# EAGLE schematic Driver_Board_Niall (EAGLE 9.1.3)
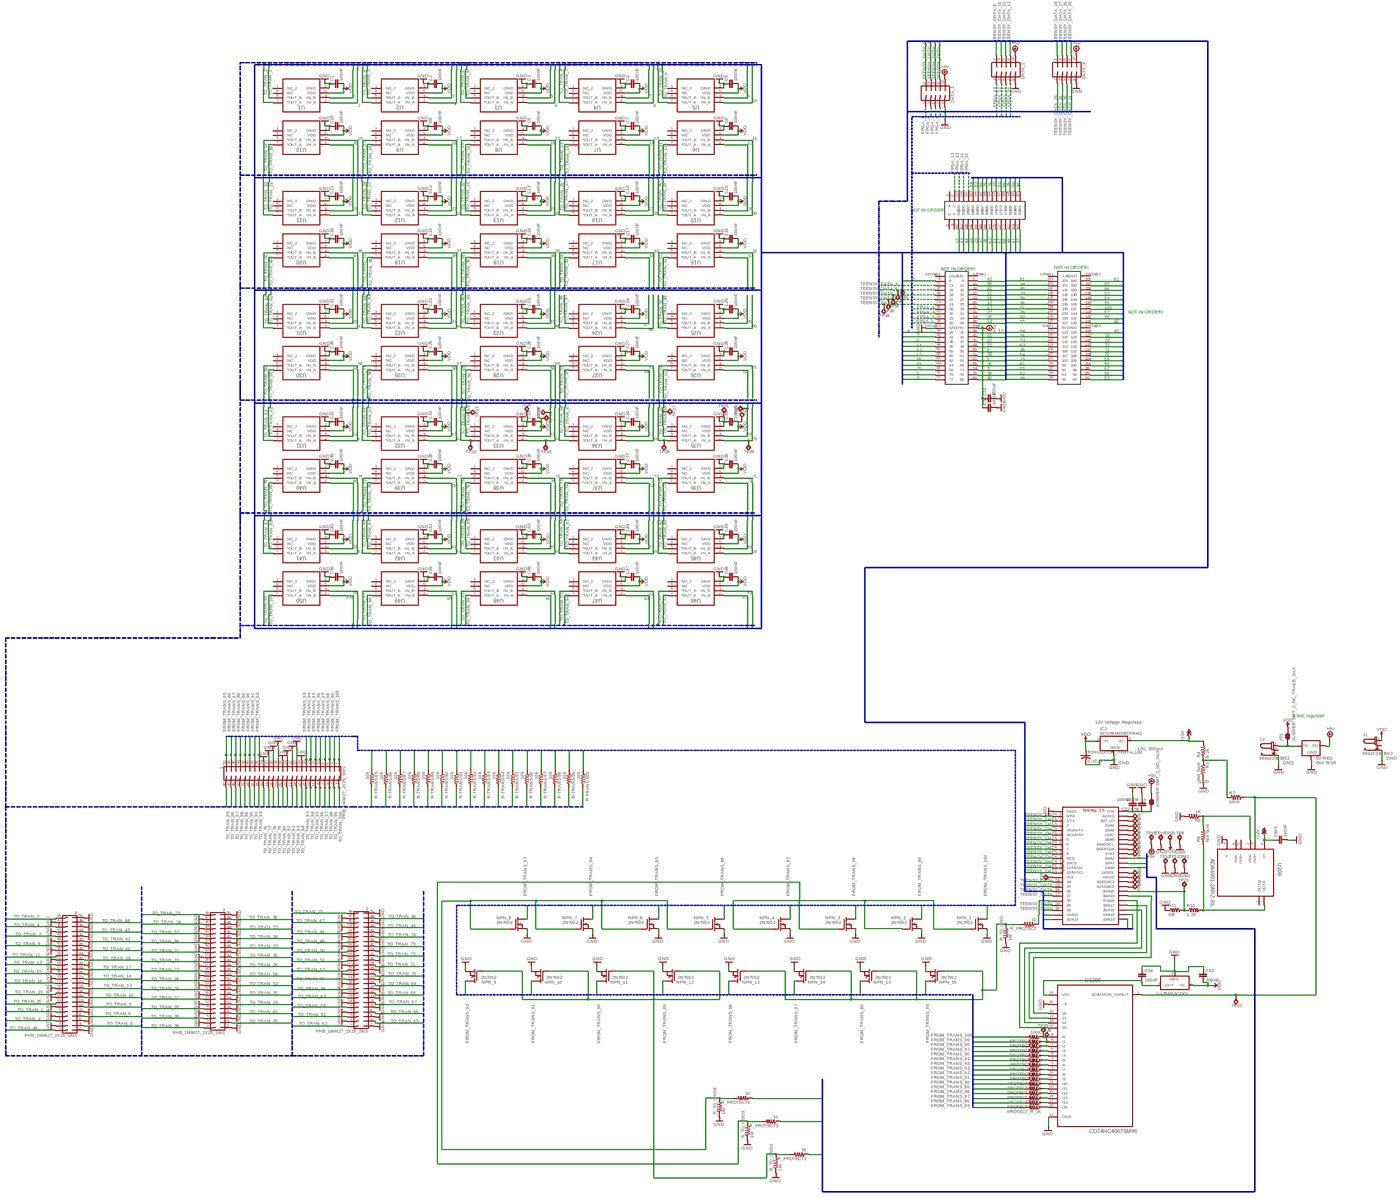
[diagram p0: schematic, sheet 1, overview]
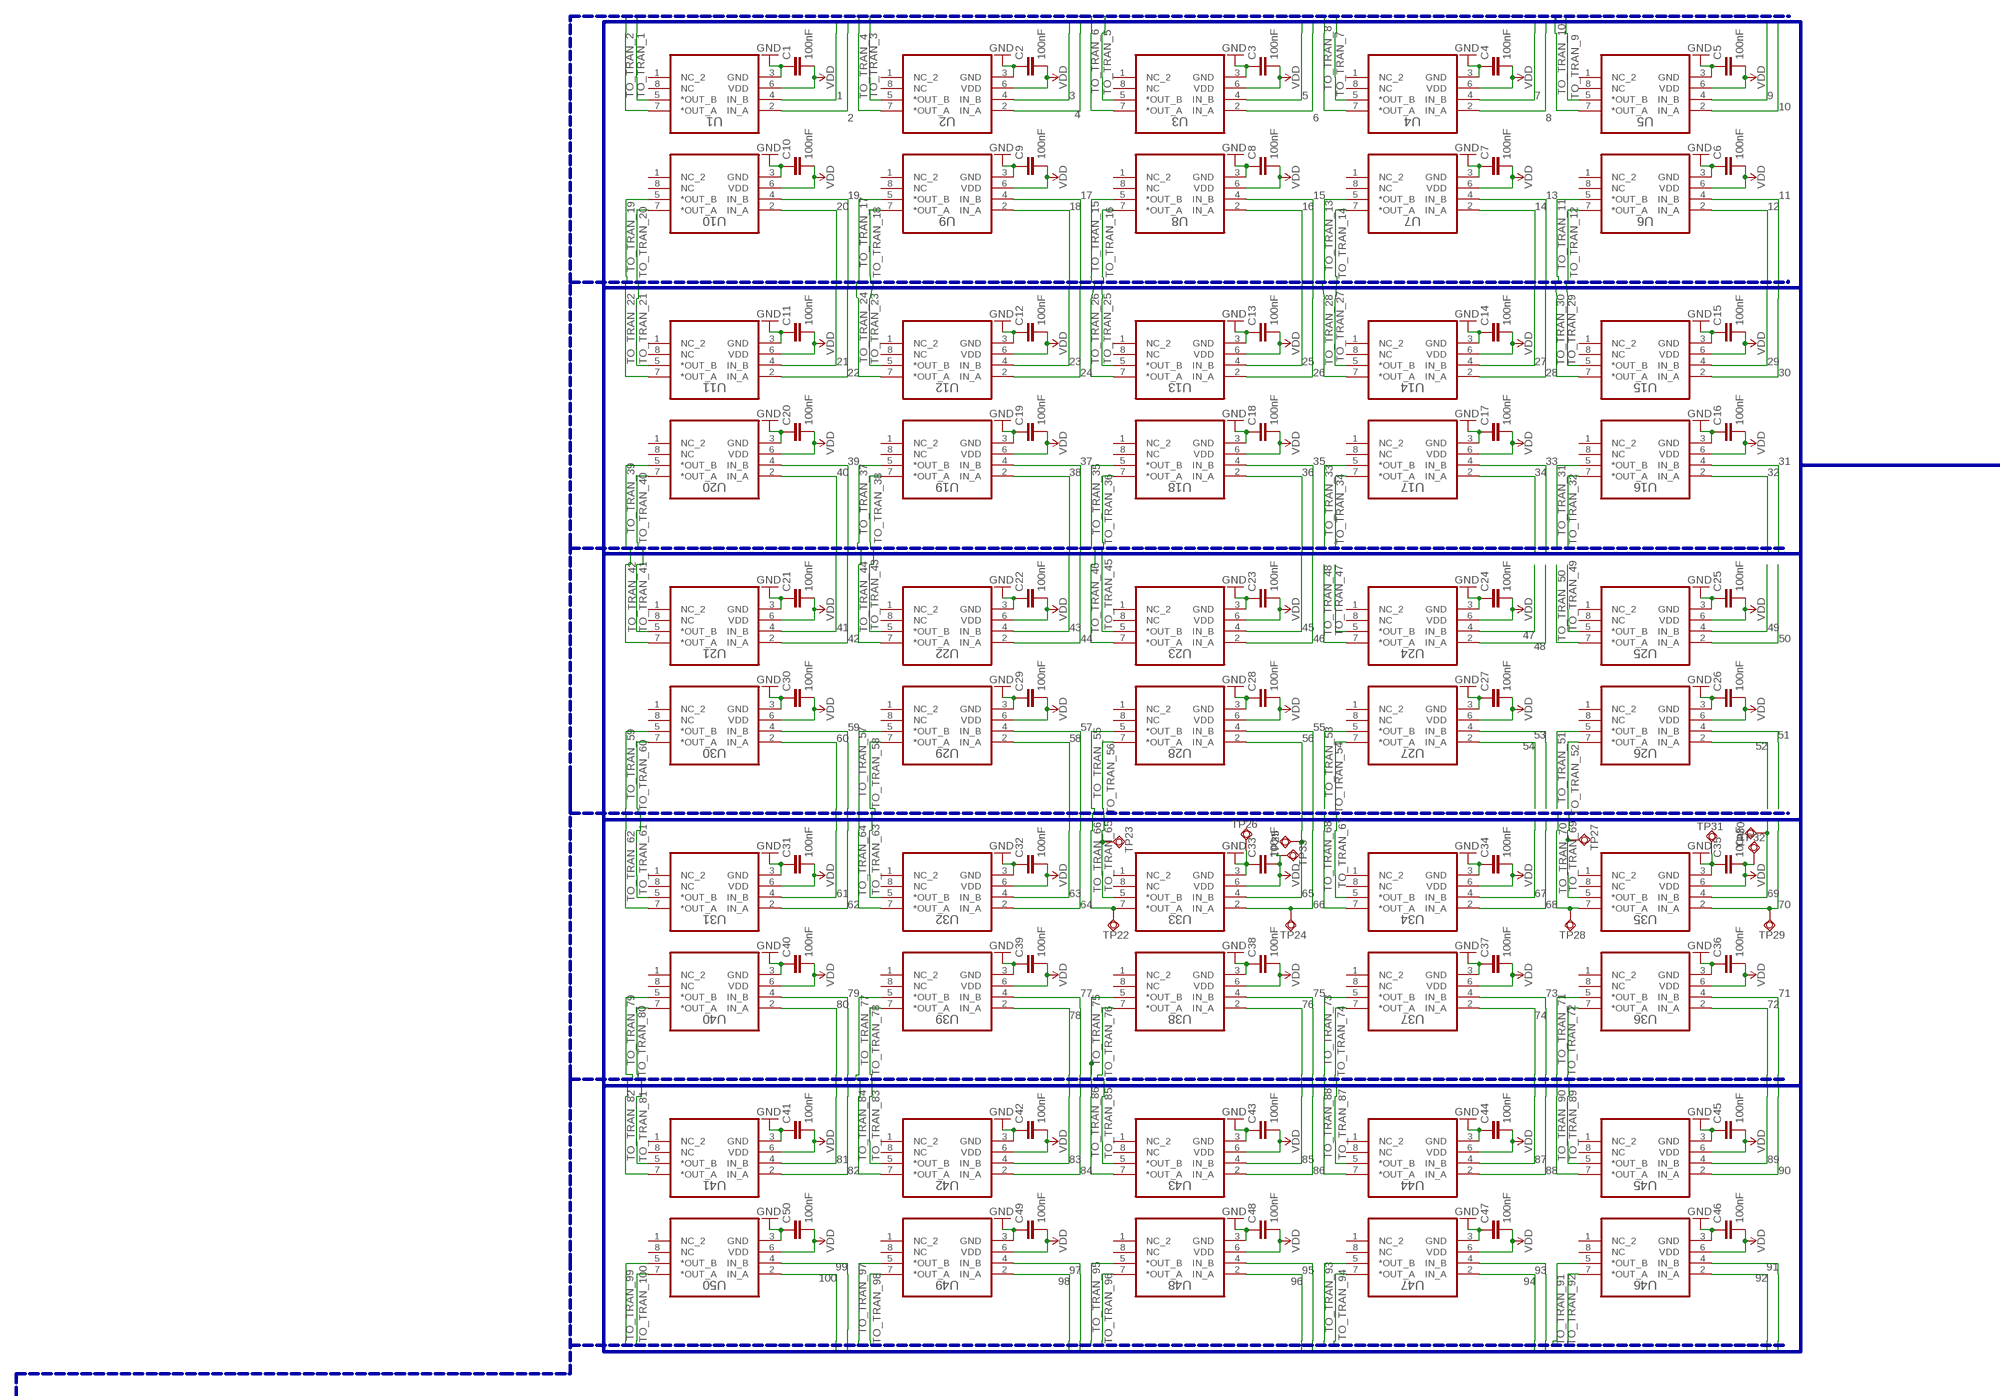
[diagram p1: schematic, sheet 1, part 1 of 4]
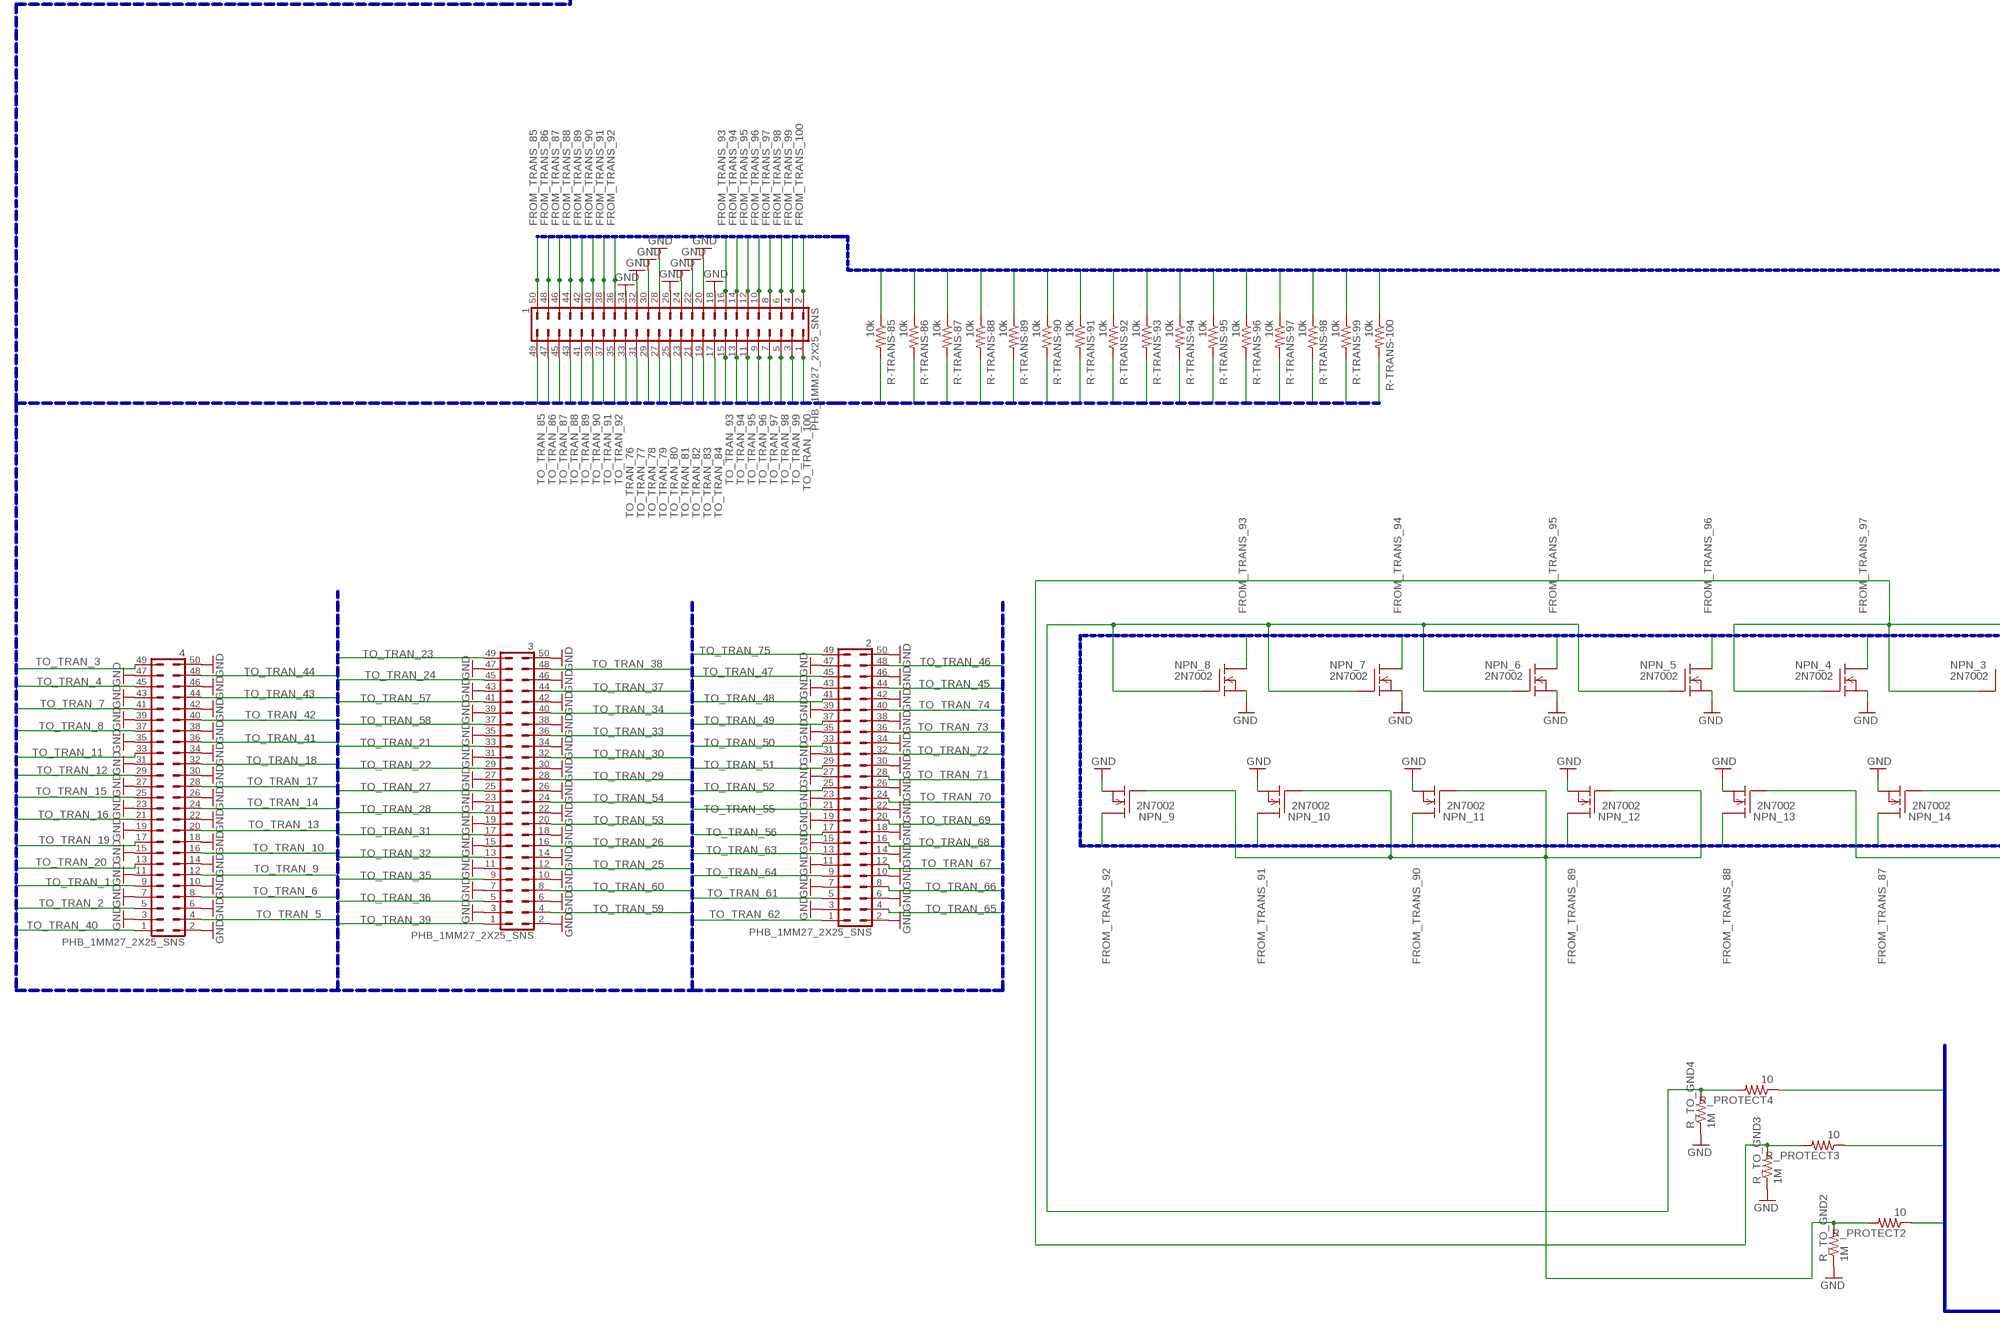
[diagram p2: schematic, sheet 1, part 2 of 4]
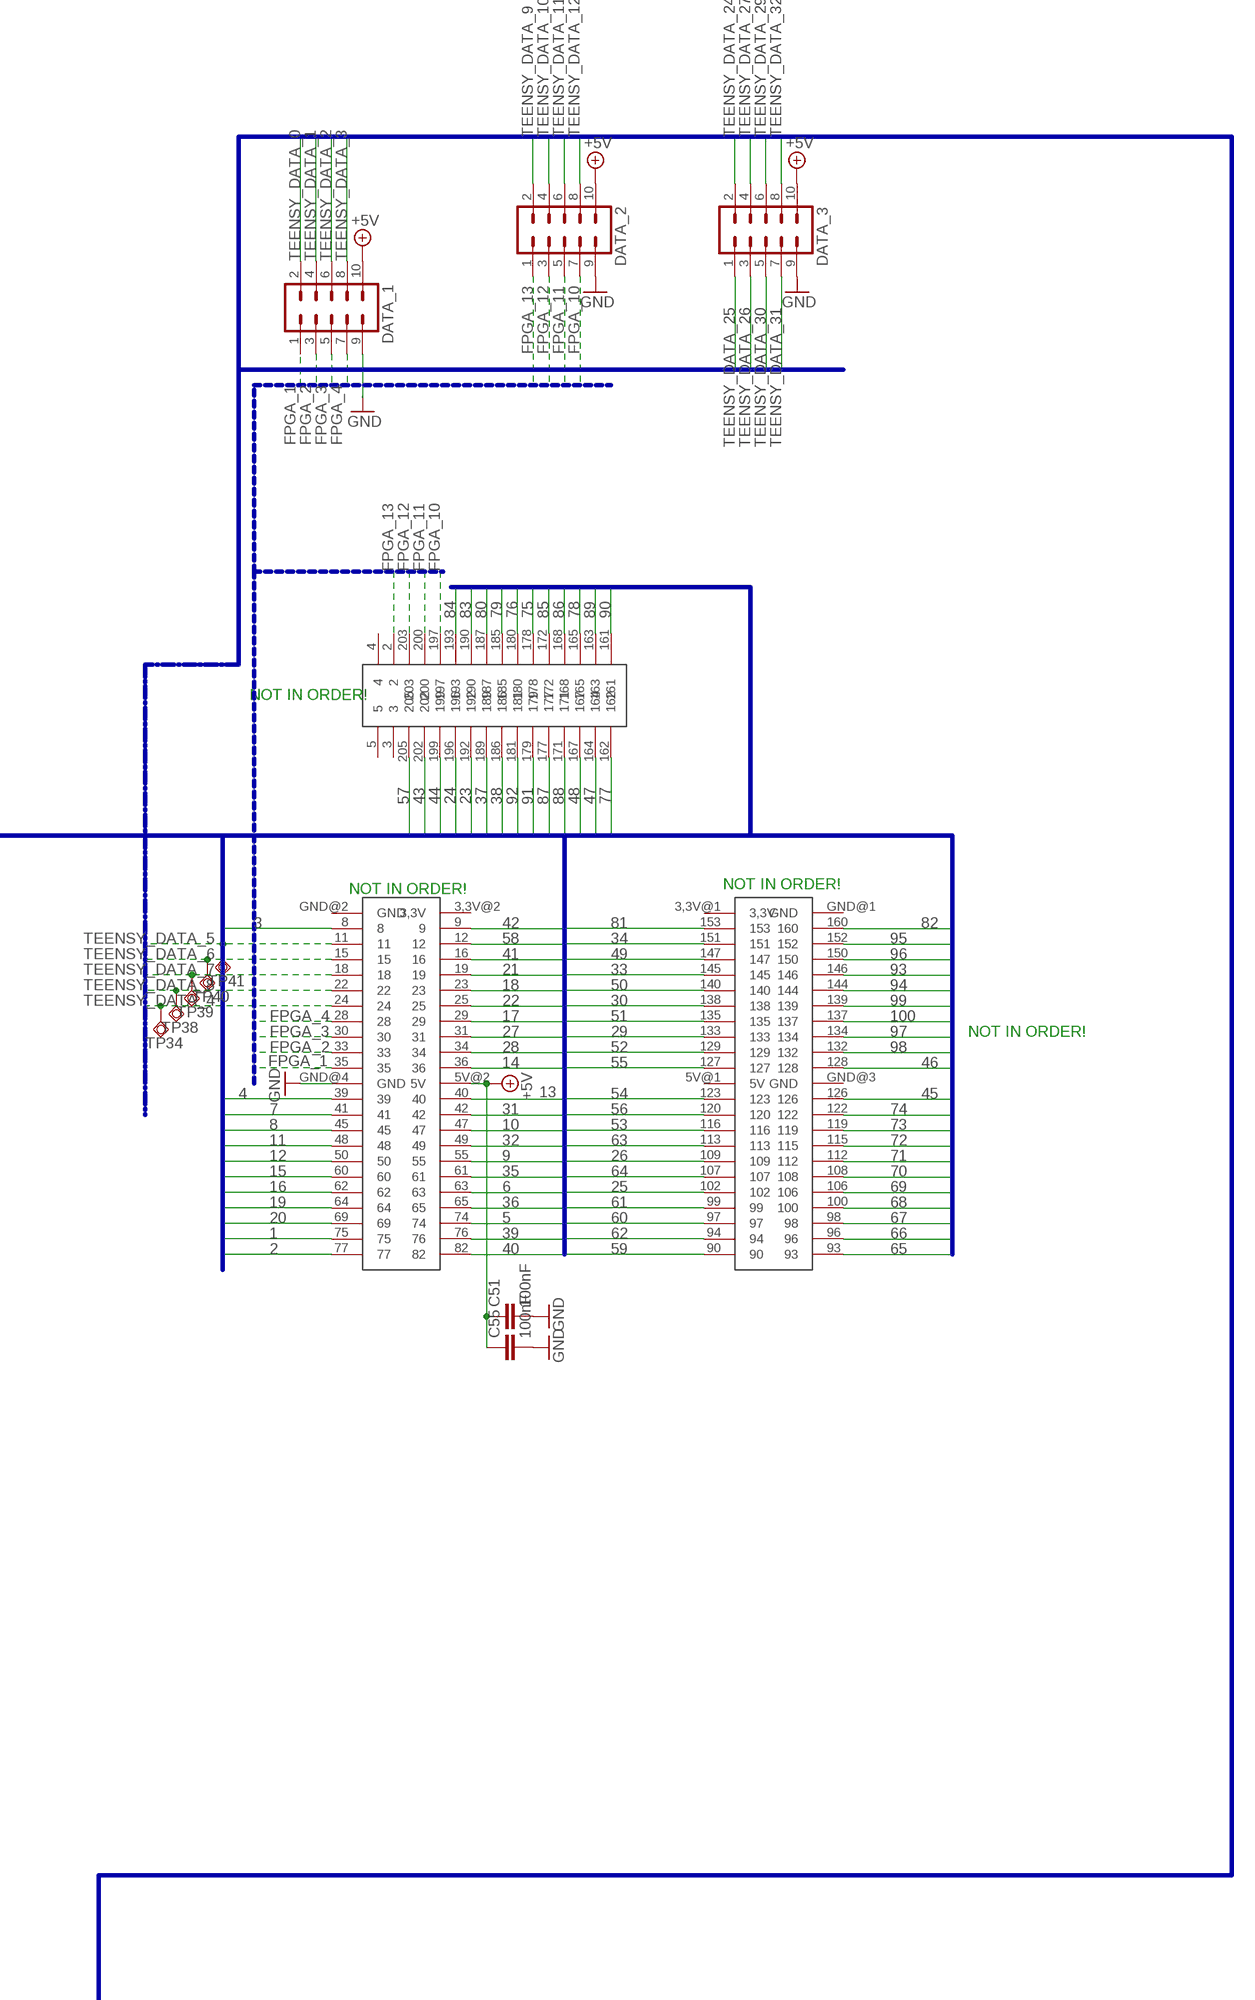
[diagram p3: schematic, sheet 1, part 3 of 4]
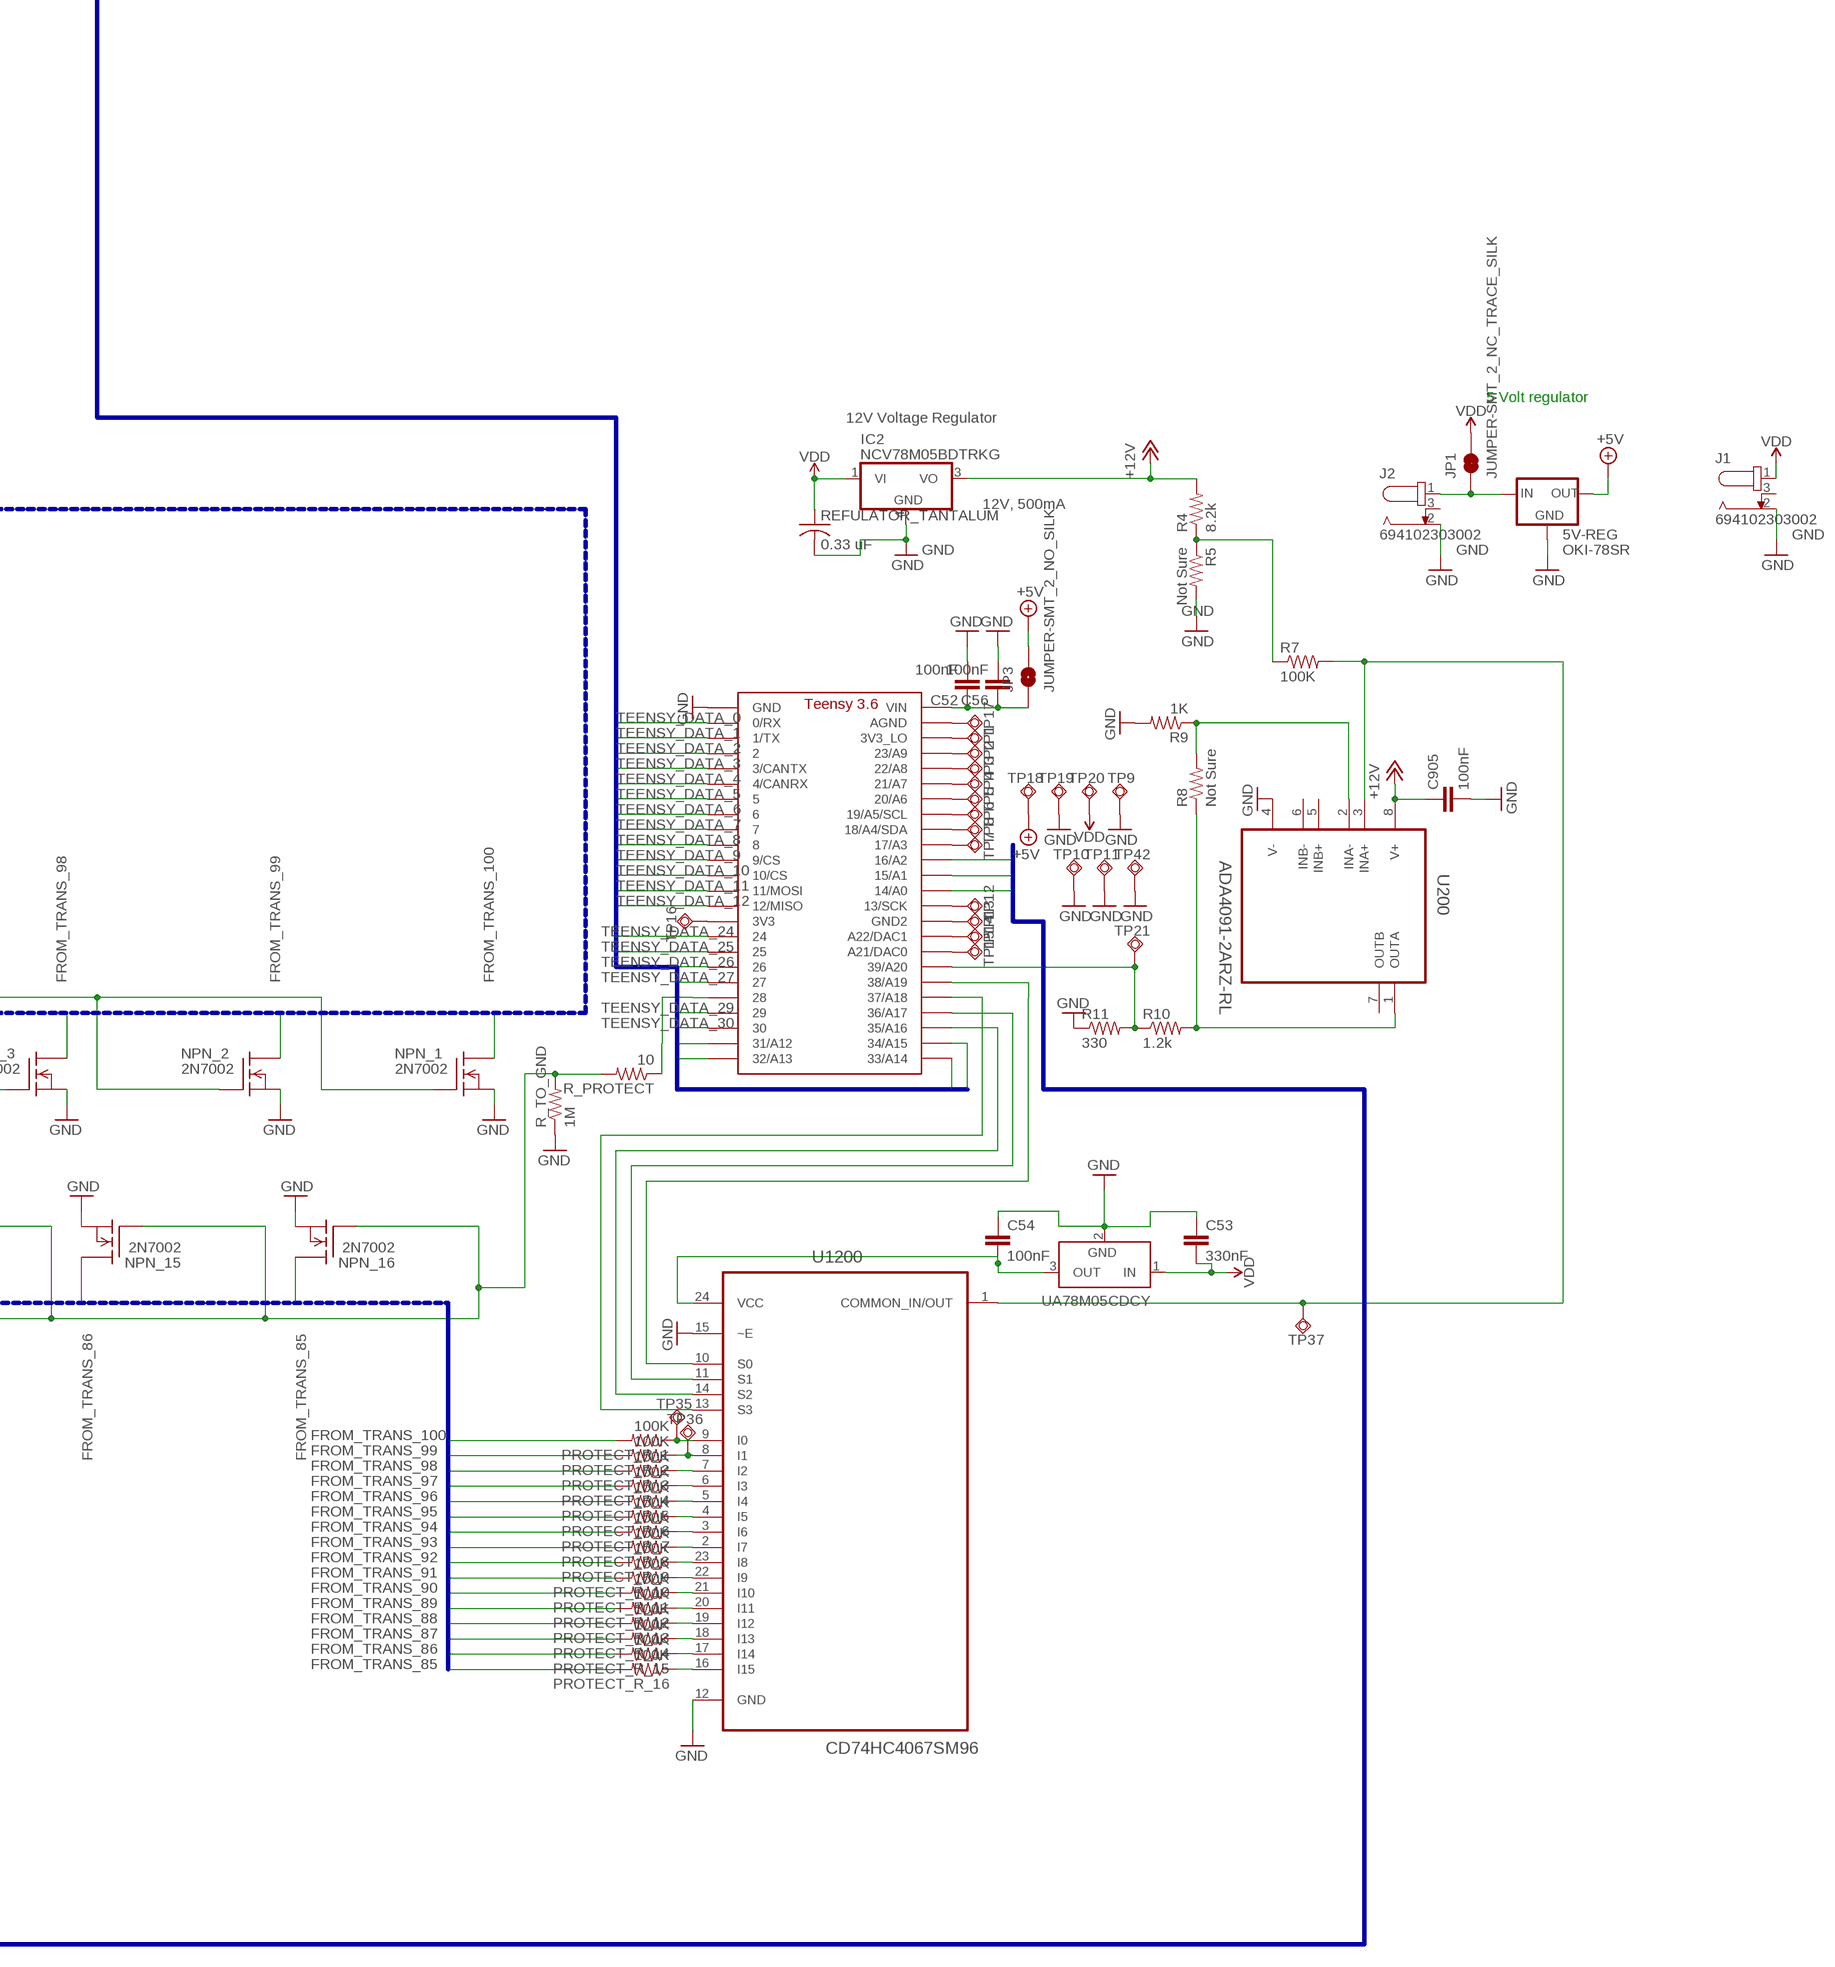
[diagram p4: schematic, sheet 1, part 4 of 4]

## Parts
1  PHB_1MM27_2X25_SNS  [PHB_1MM27_2X25_SNS]
2  PHB_1MM27_2X25_SNS  [PHB_1MM27_2X25_SNS]
3  PHB_1MM27_2X25_SNS  [PHB_1MM27_2X25_SNS]
4  PHB_1MM27_2X25_SNS  [PHB_1MM27_2X25_SNS]
5V-REG  OKI-78SR  [OKI-78SR-HORIZ]
C1  100nF  C-EUC0805  [C0805]
C2  100nF  C-EUC0805  [C0805]
C3  100nF  C-EUC0805  [C0805]
C4  100nF  C-EUC0805  [C0805]
C5  100nF  C-EUC0805  [C0805]
C6  100nF  C-EUC0805  [C0805]
C7  100nF  C-EUC0805  [C0805]
C8  100nF  C-EUC0805  [C0805]
C9  100nF  C-EUC0805  [C0805]
C10  100nF  C-EUC0805  [C0805]
C11  100nF  C-EUC0805  [C0805]
C12  100nF  C-EUC0805  [C0805]
C13  100nF  C-EUC0805  [C0805]
C14  100nF  C-EUC0805  [C0805]
C15  100nF  C-EUC0805  [C0805]
C16  100nF  C-EUC0805  [C0805]
C17  100nF  C-EUC0805  [C0805]
C18  100nF  C-EUC0805  [C0805]
C19  100nF  C-EUC0805  [C0805]
C20  100nF  C-EUC0805  [C0805]
C21  100nF  C-EUC0805  [C0805]
C22  100nF  C-EUC0805  [C0805]
C23  100nF  C-EUC0805  [C0805]
C24  100nF  C-EUC0805  [C0805]
C25  100nF  C-EUC0805  [C0805]
C26  100nF  C-EUC0805  [C0805]
C27  100nF  C-EUC0805  [C0805]
C28  100nF  C-EUC0805  [C0805]
C29  100nF  C-EUC0805  [C0805]
C30  100nF  C-EUC0805  [C0805]
C31  100nF  C-EUC0805  [C0805]
C32  100nF  C-EUC0805  [C0805]
C33  100nF  C-EUC0805  [C0805]
C34  100nF  C-EUC0805  [C0805]
C35  100nF  C-EUC0805  [C0805]
C36  100nF  C-EUC0805  [C0805]
C37  100nF  C-EUC0805  [C0805]
C38  100nF  C-EUC0805  [C0805]
C39  100nF  C-EUC0805  [C0805]
C40  100nF  C-EUC0805  [C0805]
C41  100nF  C-EUC0805  [C0805]
C42  100nF  C-EUC0805  [C0805]
C43  100nF  C-EUC0805  [C0805]
C44  100nF  C-EUC0805  [C0805]
C45  100nF  C-EUC0805  [C0805]
C46  100nF  C-EUC0805  [C0805]
C47  100nF  C-EUC0805  [C0805]
C48  100nF  C-EUC0805  [C0805]
C49  100nF  C-EUC0805  [C0805]
C50  100nF  C-EUC0805  [C0805]
C51  100nF  C-EUC0805  [C0805]
C52  100nF  C-EUC0805  [C0805]
C53  330nF  C-EUC0805  [C0805]
C54  100nF  C-EUC0805  [C0805]
C55  100nF  C-EUC0805  [C0805]
C56  100nF  C-EUC0805  [C0805]
C905  100nF  C-EUC0805  [C0805]
DATA_1  MA05-2  [MA05-2]
DATA_2  MA05-2  [MA05-2]
DATA_3  MA05-2  [MA05-2]
DIP2  CORE3S500ESMT  [CORE3S500E-SMT]
IC2  NCV78M05BDTRKG  [DPACK_3]
J1  694102303002  [69410X303002]
J2  694102303002  [69410X303002]
JP1  JUMPER-SMT_2_NC_TRACE_SILK  [SMT-JUMPER_2_NC_TRACE_SILK]
JP3  JUMPER-SMT_2_NO_SILK  [SMT-JUMPER_2_NO_SILK]
NPN_1  2N7002  [SOT23]
NPN_2  2N7002  [SOT23]
NPN_3  2N7002  [SOT23]
NPN_4  2N7002  [SOT23]
NPN_5  2N7002  [SOT23]
NPN_6  2N7002  [SOT23]
NPN_7  2N7002  [SOT23]
NPN_8  2N7002  [SOT23]
NPN_9  2N7002  [SOT23]
NPN_10  2N7002  [SOT23]
NPN_11  2N7002  [SOT23]
NPN_12  2N7002  [SOT23]
NPN_13  2N7002  [SOT23]
NPN_14  2N7002  [SOT23]
NPN_15  2N7002  [SOT23]
NPN_16  2N7002  [SOT23]
PROTECT_R_1  100K  R-US_M0805  [M0805]
PROTECT_R_2  100K  R-US_M0805  [M0805]
PROTECT_R_3  100K  R-US_M0805  [M0805]
PROTECT_R_4  100K  R-US_M0805  [M0805]
PROTECT_R_5  100K  R-US_M0805  [M0805]
PROTECT_R_6  100K  R-US_M0805  [M0805]
PROTECT_R_7  100K  R-US_M0805  [M0805]
PROTECT_R_8  100K  R-US_M0805  [M0805]
PROTECT_R_9  100K  R-US_M0805  [M0805]
PROTECT_R_10  100K  R-US_M0805  [M0805]
PROTECT_R_11  100K  R-US_M0805  [M0805]
PROTECT_R_12  100K  R-US_M0805  [M0805]
PROTECT_R_13  100K  R-US_M0805  [M0805]
PROTECT_R_14  100K  R-US_M0805  [M0805]
PROTECT_R_15  100K  R-US_M0805  [M0805]
PROTECT_R_16  100K  R-US_M0805  [M0805]
R4  8.2k  R-US_M0805  [M0805]
R5  Not Sure  R-US_M0805  [M0805]
R7  100K  R-US_M0805  [M0805]
R8  Not Sure  R-US_M0805  [M0805]
R9  1K  R-US_M0805  [M0805]
R10  1.2k  R-US_M0805  [M0805]
R11  330  R-US_M0805  [M0805]
R-TRANS-85  10k  R-US_M0805  [M0805]
R-TRANS-86  10k  R-US_M0805  [M0805]
R-TRANS-87  10k  R-US_M0805  [M0805]
R-TRANS-88  10k  R-US_M0805  [M0805]
R-TRANS-89  10k  R-US_M0805  [M0805]
R-TRANS-90  10k  R-US_M0805  [M0805]
R-TRANS-91  10k  R-US_M0805  [M0805]
R-TRANS-92  10k  R-US_M0805  [M0805]
R-TRANS-93  10k  R-US_M0805  [M0805]
R-TRANS-94  10k  R-US_M0805  [M0805]
R-TRANS-95  10k  R-US_M0805  [M0805]
R-TRANS-96  10k  R-US_M0805  [M0805]
R-TRANS-97  10k  R-US_M0805  [M0805]
R-TRANS-98  10k  R-US_M0805  [M0805]
R-TRANS-99  10k  R-US_M0805  [M0805]
R-TRANS-100  10k  R-US_M0805  [M0805]
R_PROTECT  10  R-US_M0805  [M0805]
R_PROTECT2  10  R-US_M0805  [M0805]
R_PROTECT3  10  R-US_M0805  [M0805]
R_PROTECT4  10  R-US_M0805  [M0805]
R_TO_GND  1M  R-US_M0805  [M0805]
R_TO_GND2  1M  R-US_M0805  [M0805]
R_TO_GND3  1M  R-US_M0805  [M0805]
R_TO_GND4  1M  R-US_M0805  [M0805]
REFULATOR_TANTALUM  0.33 uF  C-USC1206  [C1206]
TP1  TPSQPAD1-13  [P1-13]
TP2  TPSQPAD1-13  [P1-13]
TP3  TPSQPAD1-13  [P1-13]
TP4  TPSQPAD1-13  [P1-13]
TP5  TPSQPAD1-13  [P1-13]
TP6  TPSQPAD1-13  [P1-13]
TP7  TPSQPAD1-13  [P1-13]
TP8  TPSQPAD1-13  [P1-13]
TP9  TPSQPAD1-13  [P1-13]
TP10  TPSQPAD1-13  [P1-13]
TP11  TPSQPAD1-13  [P1-13]
TP12  TPSQPAD1-13  [P1-13]
TP13  TPSQPAD1-13  [P1-13]
TP14  TPSQPAD1-13  [P1-13]
TP15  TPSQPAD1-13  [P1-13]
TP16  TPSQPAD1-13  [P1-13]
TP17  TPSQPAD1-13  [P1-13]
TP18  TPSQPAD1-13  [P1-13]
TP19  TPSQPAD1-13  [P1-13]
TP20  TPSQPAD1-13  [P1-13]
TP21  TPSQPAD1-13  [P1-13]
TP22  TPSQPAD1-13  [P1-13]
TP23  TPSQPAD1-13  [P1-13]
TP24  TPSQPAD1-13  [P1-13]
TP25  TPSQPAD1-13  [P1-13]
TP26  TPSQPAD1-13  [P1-13]
TP27  TPSQPAD1-13  [P1-13]
TP28  TPSQPAD1-13  [P1-13]
TP29  TPSQPAD1-13  [P1-13]
TP30  TPSQPAD1-13  [P1-13]
TP31  TPSQPAD1-13  [P1-13]
TP32  TPSQPAD1-13  [P1-13]
TP33  TPSQPAD1-13  [P1-13]
TP34  TPSQPAD1-13  [P1-13]
TP35  TPSQPAD1-13  [P1-13]
TP36  TPSQPAD1-13  [P1-13]
TP37  TPSQPAD1-13  [P1-13]
TP38  TPSQPAD1-13  [P1-13]
TP39  TPSQPAD1-13  [P1-13]
TP40  TPSQPAD1-13  [P1-13]
TP41  TPSQPAD1-13  [P1-13]
TP42  TPSQPAD1-13  [P1-13]
U1  TC4427AEOA  [SOIC127P600X175-8N]
U2  TC4427AEOA  [SOIC127P600X175-8N]
U3  TC4427AEOA  [SOIC127P600X175-8N]
U4  TC4427AEOA  [SOIC127P600X175-8N]
U5  TC4427AEOA  [SOIC127P600X175-8N]
U6  TC4427AEOA  [SOIC127P600X175-8N]
U7  TC4427AEOA  [SOIC127P600X175-8N]
U8  TC4427AEOA  [SOIC127P600X175-8N]
U9  TC4427AEOA  [SOIC127P600X175-8N]
U10  TC4427AEOA  [SOIC127P600X175-8N]
U11  TC4427AEOA  [SOIC127P600X175-8N]
U12  TC4427AEOA  [SOIC127P600X175-8N]
U13  TC4427AEOA  [SOIC127P600X175-8N]
U14  TC4427AEOA  [SOIC127P600X175-8N]
U15  TC4427AEOA  [SOIC127P600X175-8N]
U16  TC4427AEOA  [SOIC127P600X175-8N]
U17  TC4427AEOA  [SOIC127P600X175-8N]
U18  TC4427AEOA  [SOIC127P600X175-8N]
U19  TC4427AEOA  [SOIC127P600X175-8N]
U20  TC4427AEOA  [SOIC127P600X175-8N]
U21  TC4427AEOA  [SOIC127P600X175-8N]
U22  TC4427AEOA  [SOIC127P600X175-8N]
U23  TC4427AEOA  [SOIC127P600X175-8N]
U24  TC4427AEOA  [SOIC127P600X175-8N]
U25  TC4427AEOA  [SOIC127P600X175-8N]
U26  TC4427AEOA  [SOIC127P600X175-8N]
U27  TC4427AEOA  [SOIC127P600X175-8N]
U28  TC4427AEOA  [SOIC127P600X175-8N]
U29  TC4427AEOA  [SOIC127P600X175-8N]
U30  TC4427AEOA  [SOIC127P600X175-8N]
U31  TC4427AEOA  [SOIC127P600X175-8N]
U32  TC4427AEOA  [SOIC127P600X175-8N]
U33  TC4427AEOA  [SOIC127P600X175-8N]
U34  TC4427AEOA  [SOIC127P600X175-8N]
U35  TC4427AEOA  [SOIC127P600X175-8N]
U36  TC4427AEOA  [SOIC127P600X175-8N]
U37  TC4427AEOA  [SOIC127P600X175-8N]
U38  TC4427AEOA  [SOIC127P600X175-8N]
U39  TC4427AEOA  [SOIC127P600X175-8N]
U40  TC4427AEOA  [SOIC127P600X175-8N]
U41  TC4427AEOA  [SOIC127P600X175-8N]
U42  TC4427AEOA  [SOIC127P600X175-8N]
U43  TC4427AEOA  [SOIC127P600X175-8N]
U44  TC4427AEOA  [SOIC127P600X175-8N]
U45  TC4427AEOA  [SOIC127P600X175-8N]
U46  TC4427AEOA  [SOIC127P600X175-8N]
U47  TC4427AEOA  [SOIC127P600X175-8N]
U48  TC4427AEOA  [SOIC127P600X175-8N]
U49  TC4427AEOA  [SOIC127P600X175-8N]
U50  TC4427AEOA  [SOIC127P600X175-8N]
U200  ADA4091-2ARZ-RL  [ADA4091-2ARZ-RL_SOIC127P600X175-8N]
U1200  CD74HC4067SM96  [SOP65P780X200-24N]
U$1  TEENSY_SMD  [TEENSY_3.6_SMD]
UA78M05CDCY  LT1129CST5  [SOT223]

## Nets
1: DIP2.75 U1.4(IN_B)
2: DIP2.77 U1.2(IN_A)
3: DIP2.8 U2.4(IN_B)
4: DIP2.39 U2.2(IN_A)
5: DIP2.74 U3.4(IN_B)
6: DIP2.63 U3.2(IN_A)
7: DIP2.41 U4.4(IN_B)
8: DIP2.45 U4.2(IN_A)
9: DIP2.55 U5.4(IN_B)
10: DIP2.47 U5.2(IN_A)
11: DIP2.48 U6.4(IN_B)
12: DIP2.50 U6.2(IN_A)
13: DIP2.40 U7.4(IN_B)
14: DIP2.36 U7.2(IN_A)
15: DIP2.60 U8.4(IN_B)
16: DIP2.62 U8.2(IN_A)
17: DIP2.29 U9.4(IN_B)
18: DIP2.23 U9.2(IN_A)
19: DIP2.64 U10.4(IN_B)
20: DIP2.69 U10.2(IN_A)
21: DIP2.19 U11.4(IN_B)
22: DIP2.25 U11.2(IN_A)
23: DIP2.192 U12.4(IN_B)
24: DIP2.196 U12.2(IN_A)
25: DIP2.102 U13.4(IN_B)
26: DIP2.109 U13.2(IN_A)
27: DIP2.31 U14.4(IN_B)
28: DIP2.34 U14.2(IN_A)
29: DIP2.133 U15.4(IN_B)
30: DIP2.138 U15.2(IN_A)
31: DIP2.42 U16.4(IN_B)
32: DIP2.49 U16.2(IN_A)
33: DIP2.145 U17.4(IN_B)
34: DIP2.151 U17.2(IN_A)
35: DIP2.61 U18.4(IN_B)
36: DIP2.65 U18.2(IN_A)
37: DIP2.189 U19.4(IN_B)
38: DIP2.186 U19.2(IN_A)
39: DIP2.76 U20.4(IN_B)
40: DIP2.82 U20.2(IN_A)
41: DIP2.16 U21.4(IN_B)
42: DIP2.9 U21.2(IN_A)
43: DIP2.202 U22.4(IN_B)
44: DIP2.199 U22.2(IN_A)
45: DIP2.126 U23.4(IN_B)
46: DIP2.128 U23.2(IN_A)
47: DIP2.164 U24.4(IN_B)
48: DIP2.167 U24.2(IN_A)
49: DIP2.147 U25.4(IN_B)
50: DIP2.140 U25.2(IN_A)
51: DIP2.135 U26.4(IN_B)
52: DIP2.129 U26.2(IN_A)
53: DIP2.116 U27.4(IN_B)
54: DIP2.123 U27.2(IN_A)
55: DIP2.127 U28.4(IN_B)
56: DIP2.120 U28.2(IN_A)
57: DIP2.205 U29.4(IN_B)
58: DIP2.12 U29.2(IN_A)
59: DIP2.90 U30.4(IN_B)
60: DIP2.97 U30.2(IN_A)
61: DIP2.99 U31.4(IN_B)
62: DIP2.94 U31.2(IN_A)
63: DIP2.113 U32.4(IN_B)
64: DIP2.107 U32.2(IN_A)
65: DIP2.93 TP25.TP U33.4(IN_B)
66: DIP2.96 TP24.TP U33.2(IN_A)
67: DIP2.98 U34.4(IN_B)
68: DIP2.100 U34.2(IN_A)
69: DIP2.106 TP30.TP U35.4(IN_B)
70: DIP2.108 TP29.TP U35.2(IN_A)
71: DIP2.112 U36.4(IN_B)
72: DIP2.115 U36.2(IN_A)
73: DIP2.119 U37.4(IN_B)
74: DIP2.122 U37.2(IN_A)
75: DIP2.178 U38.4(IN_B)
76: DIP2.180 U38.2(IN_A)
77: DIP2.162 U39.4(IN_B)
78: DIP2.165 U39.2(IN_A)
79: DIP2.185 U40.4(IN_B)
80: DIP2.187 U40.2(IN_A)
81: DIP2.153 U41.4(IN_B)
82: DIP2.160 U41.2(IN_A)
83: DIP2.190 U42.4(IN_B)
84: DIP2.193 U42.2(IN_A)
85: DIP2.172 U43.4(IN_B)
86: DIP2.168 U43.2(IN_A)
87: DIP2.177 U44.4(IN_B)
88: DIP2.171 U44.2(IN_A)
89: DIP2.163 U45.4(IN_B)
90: DIP2.161 U45.2(IN_A)
91: DIP2.179 U46.4(IN_B)
92: DIP2.181 U46.2(IN_A)
93: DIP2.146 U47.4(IN_B)
94: DIP2.144 U47.2(IN_A)
95: DIP2.152 U48.4(IN_B)
96: DIP2.150 U48.2(IN_A)
97: DIP2.134 U49.4(IN_B)
98: DIP2.132 U49.2(IN_A)
99: DIP2.139 U50.4(IN_B)
100: DIP2.137 U50.2(IN_A)
+5V: 5V-REG.OUT C51.1 C55.1 DATA_1.10 DATA_2.10 DATA_3.10 DIP2.5V@2(5V) JP3.2 TP18.TP
+12V: C905.1 IC2.3(VO) R4.2 U200.8(V+)
FET_2: R_PROTECT2.1 U$1.16/A4(16/A2)
FET_3: R_PROTECT3.1 U$1.15/A4(15/A1)
FET_4: R_PROTECT4.1 U$1.14/A3(14/A0)
FPGA_1: DATA_1.1 DIP2.35
FPGA_2: DATA_1.3 DIP2.33
FPGA_3: DATA_1.5 DIP2.30
FPGA_4: DATA_1.7 DIP2.28
FPGA_10: DATA_2.7 DIP2.197
FPGA_11: DATA_2.5 DIP2.200
FPGA_12: DATA_2.3 DIP2.203
FPGA_13: DATA_2.1 DIP2.2
FROM_TRANS_85: 1.50 NPN_16.3(D) PROTECT_R_16.2 R-TRANS-85.1
FROM_TRANS_86: 1.48 NPN_15.3(D) PROTECT_R_15.2 R-TRANS-86.1
FROM_TRANS_87: 1.46 NPN_14.3(D) PROTECT_R_14.2 R-TRANS-87.1
FROM_TRANS_88: 1.44 NPN_13.3(D) PROTECT_R_13.2 R-TRANS-88.1
FROM_TRANS_89: 1.42 NPN_12.3(D) PROTECT_R_12.2 R-TRANS-89.1
FROM_TRANS_90: 1.40 NPN_11.3(D) PROTECT_R_11.2 R-TRANS-90.1
FROM_TRANS_91: 1.38 NPN_10.3(D) PROTECT_R_10.2 R-TRANS-91.1
FROM_TRANS_92: 1.36 NPN_9.3(D) PROTECT_R_9.2 R-TRANS-92.1
FROM_TRANS_93: 1.16 NPN_8.3(D) PROTECT_R_8.2 R-TRANS-93.1
FROM_TRANS_94: 1.14 NPN_7.3(D) PROTECT_R_7.2 R-TRANS-94.1
FROM_TRANS_95: 1.12 NPN_6.3(D) PROTECT_R_6.2 R-TRANS-95.1
FROM_TRANS_96: 1.10 NPN_5.3(D) PROTECT_R_5.2 R-TRANS-96.1
FROM_TRANS_97: 1.8 NPN_4.3(D) PROTECT_R_4.2 R-TRANS-97.1
FROM_TRANS_98: 1.6 NPN_3.3(D) PROTECT_R_3.2 R-TRANS-98.1
FROM_TRANS_99: 1.4 NPN_2.3(D) PROTECT_R_2.2 R-TRANS-99.1
FROM_TRANS_100: 1.2 NPN_1.3(D) PROTECT_R_1.2 R-TRANS-100.1
GND: 1.18 1.20 1.22 1.24 1.26 1.28 1.30 1.32 1.34 2.2 2.3 2.6 2.7 2.10 2.11 2.14 2.15 2.18 2.19 2.22 2.23 2.26 2.27 2.30 2.31 2.34 2.35 2.38 2.39 2.42 2.43 2.46 2.47 2.50 3.2 3.3 3.6 3.7 3.10 3.11 3.14 3.15 3.18 3.19 3.22 3.23 3.26 3.27 3.30 3.31 3.34 3.35 3.38 3.39 3.42 3.43 3.46 3.47 3.50 4.2 4.3 4.6 4.7 4.10 4.11 4.14 4.15 4.18 4.19 4.22 4.23 4.26 4.27 4.30 4.31 4.34 4.35 4.38 4.39 4.42 4.43 4.46 4.47 4.50 5V-REG.GND C1.1 C2.1 C3.1 C4.1 C5.1 C6.1 C7.1 C8.1 C9.1 C10.1 C11.1 C12.1 C13.1 C14.1 C15.1 C16.1 C17.1 C18.1 C19.1 C20.1 C21.1 C22.1 C23.1 C24.1 C25.1 C26.1 C27.1 C28.1 C29.1 C30.1 C31.1 C32.1 C33.1 C34.1 C35.1 C36.1 C37.1 C38.1 C39.1 C40.1 C41.1 C42.1 C43.1 C44.1 C45.1 C46.1 C47.1 C48.1 C49.1 C50.1 C51.2 C52.2 C53.1 C54.1 C55.2 C56.2 C905.2 DATA_1.9 DATA_2.9 DATA_3.9 DIP2.GND@4(GND) IC2.4(GND) J1.2 J2.2 NPN_1.2(S) NPN_2.2(S) NPN_3.2(S) NPN_4.2(S) NPN_5.2(S) NPN_6.2(S) NPN_7.2(S) NPN_8.2(S) NPN_9.2(S) NPN_10.2(S) NPN_11.2(S) NPN_12.2(S) NPN_13.2(S) NPN_14.2(S) NPN_15.2(S) NPN_16.2(S) R5.2 R9.2 R11.1 R_TO_GND2.1 R_TO_GND3.1 R_TO_GND4.1 R_TO_GND.1 REFULATOR_TANTALUM.2 TP9.TP TP10.TP TP11.TP TP19.TP TP26.TP TP31.TP TP42.TP U1.3(GND) U2.3(GND) U3.3(GND) U4.3(GND) U5.3(GND) U6.3(GND) U7.3(GND) U8.3(GND) U9.3(GND) U10.3(GND) U11.3(GND) U12.3(GND) U13.3(GND) U14.3(GND) U15.3(GND) U16.3(GND) U17.3(GND) U18.3(GND) U19.3(GND) U20.3(GND) U21.3(GND) U22.3(GND) U23.3(GND) U24.3(GND) U25.3(GND) U26.3(GND) U27.3(GND) U28.3(GND) U29.3(GND) U30.3(GND) U31.3(GND) U32.3(GND) U33.3(GND) U34.3(GND) U35.3(GND) U36.3(GND) U37.3(GND) U38.3(GND) U39.3(GND) U40.3(GND) U41.3(GND) U42.3(GND) U43.3(GND) U44.3(GND) U45.3(GND) U46.3(GND) U47.3(GND) U48.3(GND) U49.3(GND) U50.3(GND) U200.4(V-) U1200.12(GND) U1200.15(~E) U$1.GND6(GND) UA78M05CDCY.2(GND)
N$1: PROTECT_R_1.1 TP35.TP U1200.9(I0)
N$2: R4.1 R5.1 R7.1
N$3: PROTECT_R_2.1 TP36.TP U1200.8(I1)
N$5: R10.1 R11.2 TP21.TP U$1.39/A3(39/A20)
N$6: U1200.10(S0) U$1.38/A3(38/A19)
N$7: R8.1 R10.2 U200.1(OUTA)
N$8: R_PROTECT.1 U$1.28
N$9: TP1.TP U$1.3V3_LO3(3V3_LO)
N$10: U1200.13(S3) U$1.37/A3(37/A18)
N$11: U1200.14(S2) U$1.35/A3(35/A16)
N$12: U1200.11(S1) U$1.36/A3(36/A17)
N$13: TP2.TP U$1.23/A3(23/A9)
N$14: R8.2 R9.1 U200.2(INA-)
N$15: TP3.TP U$1.22/A3(22/A8)
N$16: TP4.TP U$1.21/A3(21/A7)
N$17: TP5.TP U$1.20/A3(20/A6)
N$18: TP6.TP U$1.19/A5/SCL3(19/A5/SCL)
N$19: TP7.TP U$1.17/A4(17/A3)
N$20: TP8.TP U$1.18/A4/SDA3(18/A4/SDA)
N$21: NPN_1.1(G) NPN_2.1(G) NPN_3.1(G) NPN_4.1(G) R_PROTECT3.2 R_TO_GND3.2
N$23: C54.2 U1200.24(VCC) UA78M05CDCY.3(OUT)
N$24: 5V-REG.IN J2.1 JP1.1
N$25: C52.1 C56.1 JP3.1 U$1.VIN3(VIN)
N$26: NPN_5.1(G) NPN_6.1(G) NPN_7.1(G) NPN_8.1(G) R_PROTECT4.2 R_TO_GND4.2
N$27: TP12.TP U$1.13/SCK3(13/SCK)
N$28: TP13.TP U$1.GND7(GND2)
N$29: TP14.TP U$1.A22/DAC1
N$30: TP15.TP U$1.A21/DAC0
N$31: TP16.TP U$1.3V4(3V3)
N$32: R7.2 TP37.TP U200.3(INA+) U1200.1(COMMON_IN/OUT)
N$33: TP17.TP U$1.AGND3(AGND)
N$35: PROTECT_R_3.1 U1200.7(I2)
N$36: NPN_13.1(G) NPN_14.1(G) NPN_15.1(G) NPN_16.1(G) R_PROTECT.2 R_TO_GND.2
N$37: NPN_9.1(G) NPN_10.1(G) NPN_11.1(G) NPN_12.1(G) R_PROTECT2.2 R_TO_GND2.2
N$38: PROTECT_R_4.1 U1200.6(I3)
N$65: PROTECT_R_5.1 U1200.5(I4)
N$68: PROTECT_R_6.1 U1200.4(I5)
N$71: PROTECT_R_7.1 U1200.3(I6)
N$75: PROTECT_R_8.1 U1200.2(I7)
N$78: PROTECT_R_9.1 U1200.23(I8)
N$81: PROTECT_R_10.1 U1200.22(I9)
N$84: PROTECT_R_11.1 U1200.21(I10)
N$87: PROTECT_R_12.1 U1200.20(I11)
N$90: PROTECT_R_13.1 U1200.19(I12)
N$93: PROTECT_R_14.1 U1200.18(I13)
N$96: PROTECT_R_15.1 U1200.17(I14)
N$99: PROTECT_R_16.1 U1200.16(I15)
TEENSY_DATA_0: DATA_1.2 U$1.0/RX3(0/RX)
TEENSY_DATA_1: DATA_1.4 U$1.1/TX3(1/TX)
TEENSY_DATA_2: DATA_1.6 U$1.2
TEENSY_DATA_3: DATA_1.8 U$1.3/CANTX3(3/CANTX)
TEENSY_DATA_4: DIP2.24 TP34.TP U$1.4/CANRX3(4/CANRX)
TEENSY_DATA_5: DIP2.11 TP41.TP U$1.5
TEENSY_DATA_6: DIP2.15 TP40.TP U$1.6
TEENSY_DATA_7: DIP2.18 TP39.TP U$1.7
TEENSY_DATA_8: DIP2.22 TP38.TP U$1.8
TEENSY_DATA_9: DATA_2.2 U$1.9/CS3(9/CS)
TEENSY_DATA_10: DATA_2.4 U$1.10/CS3(10/CS)
TEENSY_DATA_11: DATA_2.6 U$1.11/MOSI3(11/MOSI)
TEENSY_DATA_12: DATA_2.8 U$1.12/MISO3(12/MISO)
TEENSY_DATA_24: DATA_3.2 U$1.24
TEENSY_DATA_25: DATA_3.1 U$1.25
TEENSY_DATA_26: DATA_3.3 U$1.26
TEENSY_DATA_27: DATA_3.4 U$1.27
TEENSY_DATA_29: DATA_3.6 U$1.29
TEENSY_DATA_30: DATA_3.5 U$1.30
TEENSY_DATA_31: DATA_3.7 U$1.31/A3(31/A12)
TEENSY_DATA_32: DATA_3.8 U$1.32/A3(32/A13)
TEENSY_DATA_33: U$1.33/A3(33/A14)
TEENSY_DATA_34: U$1.34/A3(34/A15)
TO_TRAN_1: 4.9 U1.5(*OUT_B)
TO_TRAN_2: 4.5 U1.7(*OUT_A)
TO_TRAN_3: 4.49 U2.5(*OUT_B)
TO_TRAN_4: 4.45 U2.7(*OUT_A)
TO_TRAN_5: 4.4 U3.5(*OUT_B)
TO_TRAN_6: 4.8 U3.7(*OUT_A)
TO_TRAN_7: 4.41 U4.5(*OUT_B)
TO_TRAN_8: 4.37 U4.7(*OUT_A)
TO_TRAN_9: 4.12 U5.5(*OUT_B)
TO_TRAN_10: 4.16 U5.7(*OUT_A)
TO_TRAN_11: 4.33 U6.5(*OUT_B)
TO_TRAN_12: 4.29 U6.7(*OUT_A)
TO_TRAN_13: 4.20 U7.5(*OUT_B)
TO_TRAN_14: 4.24 U7.7(*OUT_A)
TO_TRAN_15: 4.25 U8.5(*OUT_B)
TO_TRAN_16: 4.21 U8.7(*OUT_A)
TO_TRAN_17: 4.28 U9.5(*OUT_B)
TO_TRAN_18: 4.32 U9.7(*OUT_A)
TO_TRAN_19: 4.17 U10.5(*OUT_B)
TO_TRAN_20: 4.13 U10.7(*OUT_A)
TO_TRAN_21: 3.33 U11.5(*OUT_B)
TO_TRAN_22: 3.29 U11.7(*OUT_A)
TO_TRAN_23: 3.49 U12.5(*OUT_B)
TO_TRAN_24: 3.45 U12.7(*OUT_A)
TO_TRAN_25: 3.12 U13.5(*OUT_B)
TO_TRAN_26: 3.16 U13.7(*OUT_A)
TO_TRAN_27: 3.25 U14.5(*OUT_B)
TO_TRAN_28: 3.21 U14.7(*OUT_A)
TO_TRAN_29: 3.28 U15.5(*OUT_B)
TO_TRAN_30: 3.32 U15.7(*OUT_A)
TO_TRAN_31: 3.17 U16.5(*OUT_B)
TO_TRAN_32: 3.13 U16.7(*OUT_A)
TO_TRAN_33: 3.36 U17.5(*OUT_B)
TO_TRAN_34: 3.40 U17.7(*OUT_A)
TO_TRAN_35: 3.9 U18.5(*OUT_B)
TO_TRAN_36: 3.5 U18.7(*OUT_A)
TO_TRAN_37: 3.44 U19.5(*OUT_B)
TO_TRAN_38: 3.48 U19.7(*OUT_A)
TO_TRAN_39: 3.1 U20.5(*OUT_B)
TO_TRAN_40: 4.1 U20.7(*OUT_A)
TO_TRAN_41: 4.36 U21.5(*OUT_B)
TO_TRAN_42: 4.40 U21.7(*OUT_A)
TO_TRAN_43: 4.44 U22.5(*OUT_B)
TO_TRAN_44: 4.48 U22.7(*OUT_A)
TO_TRAN_45: 2.44 U23.5(*OUT_B)
TO_TRAN_46: 2.48 U23.7(*OUT_A)
TO_TRAN_47: 2.45 U24.5(*OUT_B)
TO_TRAN_48: 2.41 U24.7(*OUT_A)
TO_TRAN_49: 2.37 U25.5(*OUT_B)
TO_TRAN_50: 2.33 U25.7(*OUT_A)
TO_TRAN_51: 2.29 U26.5(*OUT_B)
TO_TRAN_52: 2.25 U26.7(*OUT_A)
TO_TRAN_53: 3.20 U27.5(*OUT_B)
TO_TRAN_54: 3.24 U27.7(*OUT_A)
TO_TRAN_55: 2.21 U28.5(*OUT_B)
TO_TRAN_56: 2.17 U28.7(*OUT_A)
TO_TRAN_57: 3.41 U29.5(*OUT_B)
TO_TRAN_58: 3.37 U29.7(*OUT_A)
TO_TRAN_59: 3.4 U30.5(*OUT_B)
TO_TRAN_60: 3.8 U30.7(*OUT_A)
TO_TRAN_61: 2.5 U31.5(*OUT_B)
TO_TRAN_62: 2.1 U31.7(*OUT_A)
TO_TRAN_63: 2.13 U32.5(*OUT_B)
TO_TRAN_64: 2.9 U32.7(*OUT_A)
TO_TRAN_65: 2.4 TP23.TP U33.5(*OUT_B)
TO_TRAN_66: 2.8 TP22.TP U33.7(*OUT_A)
TO_TRAN_67: 2.12 U34.5(*OUT_B)
TO_TRAN_68: 2.16 U34.7(*OUT_A)
TO_TRAN_69: 2.20 TP27.TP U35.5(*OUT_B)
TO_TRAN_70: 2.24 TP28.TP U35.7(*OUT_A)
TO_TRAN_71: 2.28 U36.5(*OUT_B)
TO_TRAN_72: 2.32 U36.7(*OUT_A)
TO_TRAN_73: 2.36 U37.5(*OUT_B)
TO_TRAN_74: 2.40 U37.7(*OUT_A)
TO_TRAN_75: 2.49 U38.5(*OUT_B)
TO_TRAN_76: 1.33 U38.7(*OUT_A)
TO_TRAN_77: 1.31 U39.5(*OUT_B)
TO_TRAN_78: 1.29 U39.7(*OUT_A)
TO_TRAN_79: 1.27 U40.5(*OUT_B)
TO_TRAN_80: 1.25 U40.7(*OUT_A)
TO_TRAN_81: 1.23 U41.5(*OUT_B)
TO_TRAN_82: 1.21 U41.7(*OUT_A)
TO_TRAN_83: 1.19 U42.5(*OUT_B)
TO_TRAN_84: 1.17 U42.7(*OUT_A)
TO_TRAN_85: 1.49 R-TRANS-85.2 U43.5(*OUT_B)
TO_TRAN_86: 1.47 R-TRANS-86.2 U43.7(*OUT_A)
TO_TRAN_87: 1.45 R-TRANS-87.2 U44.5(*OUT_B)
TO_TRAN_88: 1.43 R-TRANS-88.2 U44.7(*OUT_A)
TO_TRAN_89: 1.41 R-TRANS-89.2 U45.5(*OUT_B)
TO_TRAN_90: 1.39 R-TRANS-90.2 U45.7(*OUT_A)
TO_TRAN_91: 1.37 R-TRANS-91.2 U46.5(*OUT_B)
TO_TRAN_92: 1.35 R-TRANS-92.2 U46.7(*OUT_A)
TO_TRAN_93: 1.15 R-TRANS-93.2 U47.5(*OUT_B)
TO_TRAN_94: 1.13 R-TRANS-94.2 U47.7(*OUT_A)
TO_TRAN_95: 1.11 R-TRANS-95.2 U48.5(*OUT_B)
TO_TRAN_96: 1.9 R-TRANS-96.2 U48.7(*OUT_A)
TO_TRAN_97: 1.7 R-TRANS-97.2 U49.5(*OUT_B)
TO_TRAN_98: 1.5 R-TRANS-98.2 U49.7(*OUT_A)
TO_TRAN_99: 1.3 R-TRANS-99.2 U50.5(*OUT_B)
TO_TRAN_100: 1.1 R-TRANS-100.2 U50.7(*OUT_A)
VDD: C1.2 C2.2 C3.2 C4.2 C5.2 C6.2 C7.2 C8.2 C9.2 C10.2 C11.2 C12.2 C13.2 C14.2 C15.2 C16.2 C17.2 C18.2 C19.2 C20.2 C21.2 C22.2 C23.2 C24.2 C25.2 C26.2 C27.2 C28.2 C29.2 C30.2 C31.2 C32.2 C33.2 C34.2 C35.2 C36.2 C37.2 C38.2 C39.2 C40.2 C41.2 C42.2 C43.2 C44.2 C45.2 C46.2 C47.2 C48.2 C49.2 C50.2 C53.2 IC2.1(VI) J1.1 JP1.2 REFULATOR_TANTALUM.1 TP20.TP TP32.TP TP33.TP U1.6(VDD) U2.6(VDD) U3.6(VDD) U4.6(VDD) U5.6(VDD) U6.6(VDD) U7.6(VDD) U8.6(VDD) U9.6(VDD) U10.6(VDD) U11.6(VDD) U12.6(VDD) U13.6(VDD) U14.6(VDD) U15.6(VDD) U16.6(VDD) U17.6(VDD) U18.6(VDD) U19.6(VDD) U20.6(VDD) U21.6(VDD) U22.6(VDD) U23.6(VDD) U24.6(VDD) U25.6(VDD) U26.6(VDD) U27.6(VDD) U28.6(VDD) U29.6(VDD) U30.6(VDD) U31.6(VDD) U32.6(VDD) U33.6(VDD) U34.6(VDD) U35.6(VDD) U36.6(VDD) U37.6(VDD) U38.6(VDD) U39.6(VDD) U40.6(VDD) U41.6(VDD) U42.6(VDD) U43.6(VDD) U44.6(VDD) U45.6(VDD) U46.6(VDD) U47.6(VDD) U48.6(VDD) U49.6(VDD) U50.6(VDD) UA78M05CDCY.1(IN)
Unconnected: DIP2.3 DIP2.3,3V@1(3,3V) DIP2.3,3V@2(3,3V) DIP2.4 DIP2.5 DIP2.5V@1(5V) DIP2.GND@1(GND) DIP2.GND@2(GND) DIP2.GND@3(GND) J1.3 J2.3 U1.1(NC_2) U1.8(NC) U2.1(NC_2) U2.8(NC) U3.1(NC_2) U3.8(NC) U4.1(NC_2) U4.8(NC) U5.1(NC_2) U5.8(NC) U6.1(NC_2) U6.8(NC) U7.1(NC_2) U7.8(NC) U8.1(NC_2) U8.8(NC) U9.1(NC_2) U9.8(NC) U10.1(NC_2) U10.8(NC) U11.1(NC_2) U11.8(NC) U12.1(NC_2) U12.8(NC) U13.1(NC_2) U13.8(NC) U14.1(NC_2) U14.8(NC) U15.1(NC_2) U15.8(NC) U16.1(NC_2) U16.8(NC) U17.1(NC_2) U17.8(NC) U18.1(NC_2) U18.8(NC) U19.1(NC_2) U19.8(NC) U20.1(NC_2) U20.8(NC) U21.1(NC_2) U21.8(NC) U22.1(NC_2) U22.8(NC) U23.1(NC_2) U23.8(NC) U24.1(NC_2) U24.8(NC) U25.1(NC_2) U25.8(NC) U26.1(NC_2) U26.8(NC) U27.1(NC_2) U27.8(NC) U28.1(NC_2) U28.8(NC) U29.1(NC_2) U29.8(NC) U30.1(NC_2) U30.8(NC) U31.1(NC_2) U31.8(NC) U32.1(NC_2) U32.8(NC) U33.1(NC_2) U33.8(NC) U34.1(NC_2) U34.8(NC) U35.1(NC_2) U35.8(NC) U36.1(NC_2) U36.8(NC) U37.1(NC_2) U37.8(NC) U38.1(NC_2) U38.8(NC) U39.1(NC_2) U39.8(NC) U40.1(NC_2) U40.8(NC) U41.1(NC_2) U41.8(NC) U42.1(NC_2) U42.8(NC) U43.1(NC_2) U43.8(NC) U44.1(NC_2) U44.8(NC) U45.1(NC_2) U45.8(NC) U46.1(NC_2) U46.8(NC) U47.1(NC_2) U47.8(NC) U48.1(NC_2) U48.8(NC) U49.1(NC_2) U49.8(NC) U50.1(NC_2) U50.8(NC) U200.5(INB+) U200.6(INB-) U200.7(OUTB)

## Buses
1,2,3,4,5,6,7,8,9,10,11,12,13,14,15,16,17,18,19,20,21,22,23,24,25,26,27,28,29,30,31,32,33,34,35,36,37,38,39,40,41,42,43,44,45,46,47,48,49,50,51,52,53,54,55,56,57,58,59,60,61,62,63,64,65,66,67,68,69,70,71,72,73,74,75,76,77,78,79,80,81,82,83,84,85,86,87,88,89,90,91,92,93,94,95,96,97,98,99,100
TO_TRAN:TO_TRAN_1,TO_TRAN_2,TO_TRAN_3,TO_TRAN_4,TO_TRAN_5,TO_TRAN_6,TO_TRAN_7,TO_TRAN_8,TO_TRAN_9,TO_TRAN_10,TO_TRAN_11,TO_TRAN_12,TO_TRAN_13,TO_TRAN_14,TO_TRAN_15,TO_TRAN_16,TO_TRAN_17,TO_TRAN_18,TO_TRAN_19,TO_TRAN_20,TO_TRAN_21,TO_TRAN_22,TO_TRAN_23,TO_TRAN_24,TO_TRAN_25,TO_TRAN_26,TO_TRAN_27,TO_TRAN_28,TO_TRAN_29,TO_TRAN_30,TO_TRAN_31,TO_TRAN_32,TO_TRAN_33,TO_TRAN_34,TO_TRAN_35,TO_TRAN_36,TO_TRAN_37,TO_TRAN_38,TO_TRAN_39,TO_TRAN_40,TO_TRAN_41,TO_TRAN_42,TO_TRAN_43,TO_TRAN_44,TO_TRAN_45,TO_TRAN_46,TO_TRAN_47,TO_TRAN_48,TO_TRAN_49,TO_TRAN_50,TO_TRAN_51,TO_TRAN_52,TO_TRAN_53,TO_TRAN_54,TO_TRAN_55,TO_TRAN_56,TO_TRAN_57,TO_TRAN_58,TO_TRAN_59,TO_TRAN_60,TO_TRAN_61,TO_TRAN_62,TO_TRAN_63,TO_TRAN_64,TO_TRAN_65,TO_TRAN_66,TO_TRAN_67,TO_TRAN_68,TO_TRAN_69,TO_TRAN_70,TO_TRAN_71,TO_TRAN_72,TO_TRAN_73,TO_TRAN_74,TO_TRAN_75,TO_TRAN_76,TO_TRAN_77,TO_TRAN_78,TO_TRAN_79,TO_TRAN_80,TO_TRAN_81,TO_TRAN_82,TO_TRAN_83,TO_TRAN_84,TO_TRAN_85,TO_TRAN_86,TO_TRAN_87,TO_TRAN_88,TO_TRAN_89,TO_TRAN_90,TO_TRAN_91,TO_TRAN_92,TO_TRAN_93,TO_TRAN_94,TO_TRAN_95,TO_TRAN_96,TO_TRAN_97,TO_TRAN_98,TO_TRAN_99,TO_TRAN_100
FROM_TRANS:FROM_TRANS_1,FROM_TRANS_2,FROM_TRANS_3,FROM_TRANS_4,FROM_TRANS_5,FROM_TRANS_6,FROM_TRANS_7,FROM_TRANS_8,FROM_TRANS_9,FROM_TRANS_10,FROM_TRANS_11,FROM_TRANS_12,FROM_TRANS_13,FROM_TRANS_14,FROM_TRANS_15,FROM_TRANS_16,FROM_TRANS_17,FROM_TRANS_18,FROM_TRANS_19,FROM_TRANS_20,FROM_TRANS_21,FROM_TRANS_22,FROM_TRANS_23,FROM_TRANS_24,FROM_TRANS_25,FROM_TRANS_26,FROM_TRANS_27,FROM_TRANS_28,FROM_TRANS_29,FROM_TRANS_30,FROM_TRANS_31,FROM_TRANS_32,FROM_TRANS_33,FROM_TRANS_34,FROM_TRANS_35,FROM_TRANS_36,FROM_TRANS_37,FROM_TRANS_38,FROM_TRANS_39,FROM_TRANS_40,FROM_TRANS_41,FROM_TRANS_42,FROM_TRANS_43,FROM_TRANS_44,FROM_TRANS_45,FROM_TRANS_46,FROM_TRANS_47,FROM_TRANS_48,FROM_TRANS_49,FROM_TRANS_50,FROM_TRANS_51,FROM_TRANS_52,FROM_TRANS_53,FROM_TRANS_54,FROM_TRANS_55,FROM_TRANS_56,FROM_TRANS_57,FROM_TRANS_58,FROM_TRANS_59,FROM_TRANS_60,FROM_TRANS_61,FROM_TRANS_62,FROM_TRANS_63,FROM_TRANS_64,FROM_TRANS_65,FROM_TRANS_66,FROM_TRANS_67,FROM_TRANS_68,FROM_TRANS_69,FROM_TRANS_70,FROM_TRANS_71,FROM_TRANS_72,FROM_TRANS_73,FROM_TRANS_74,FROM_TRANS_75,FROM_TRANS_76,FROM_TRANS_77,FROM_TRANS_78,FROM_TRANS_79,FROM_TRANS_80,FROM_TRANS_81,FROM_TRANS_82,FROM_TRANS_83,FROM_TRANS_84,FROM_TRANS_85,FROM_TRANS_86,FROM_TRANS_87,FROM_TRANS_88,FROM_TRANS_89,FROM_TRANS_90,FROM_TRANS_91,FROM_TRANS_92,FROM_TRANS_93,FROM_TRANS_94,FROM_TRANS_95,FROM_TRANS_96,FROM_TRANS_97,FROM_TRANS_98,FROM_TRANS_99,FROM_TRANS_100
TEENSY_DATA:TEENSY_DATA_0,TEENSY_DATA_1,TEENSY_DATA_2,TEENSY_DATA_3,TEENSY_DATA_4,TEENSY_DATA_5,TEENSY_DATA_6,TEENSY_DATA_7,TEENSY_DATA_8,TEENSY_DATA_9,TEENSY_DATA_10,TEENSY_DATA_11,TEENSY_DATA_12,TEENSY_DATA_24,TEENSY_DATA_25,TEENSY_DATA_26,TEENSY_DATA_27,TEENSY_DATA_29,TEENSY_DATA_30,TEENSY_DATA_31,TEENSY_DATA_32,TEENSY_DATA_33,TEENSY_DATA_34
FPGA:FPGA_1,FPGA_2,FPGA_3,FPGA_4,FPGA_5,FPGA_6,FPGA_7,FPGA_8,FPGA_9,FPGA_10,FPGA_11,FPGA_12,FPGA_13,FPGA_14,FPGA_15
FET:FET_2,FET_3,FET_4

## Notes on the sheet
- NOT IN ORDER!
- NOT IN ORDER!
- NOT IN ORDER!
- NOT IN ORDER!
- 5 Volt regulator
- 12V Voltage Regulator
- 12V, 500mA

## Power pins joined to a net without a drawn wire
GND: UA78M05CDCY.4(GND)

## Library data of the parts
1-4 = _hhn_con_pinhead_box_1mm27:PHB_1MM27_2X25_*: Pin Header Box-Type, 1.27mm/0.5"/50mil Pitch, 2x25 Circuits Note: see library description for an important note about THT-version
5V-REG = Parts:OKI-78SR
C1-C56 C905 = resistor:C-EU: CAPACITOR, European symbol
DATA_1-DATA_3 = Pin_headers:MA05-2: PIN HEADER; OC_FARNELL: unknown; OC_NEWARK: unknown
DIP2 = Parts:CORE3S500E: A Xilinx Spartan 3E FPGA module.
IC2 = linear:NCV78M: 500 mA Positive Voltage Regulators Source: Data sheet <http://www.onsemi.com/pub_link/Collateral/MC78M00-D.PDF>
J1 J2 = SnapEDA-Library:694102303002: WR-DC_DC Power Jack_Right Angled_THT Center Pin Ø1.0_Plug ID Ø1.05_Plug OD Ø3.5 ;=>Code : Con_WR-DC_THT_6941xx303002_694102303002 <http://katalog.we-online.de/media/images/eican/Con_WR-DC_THT_6941xx303002_pf2.jpg> Details see: http://katalog.we-online.de/em/datasheet/6941xx303002.pdf Created 2014-10-08, Karrer Zheng 2014 (C) Wurth Elektronik
JP1 = SparkFun-Jumpers:JUMPER-SMT_2_NC_TRACE: Normally closed trace jumper This jumper has a trace between two pads so it's normally closed (NC). Use a razor knife to open the connection. For best results follow the IPC guidelines for cutting traces: Cutout at least 0.063 mm (0.005 in). Remove all loose material to clean up the cut area. Seal the cut with an approved epoxy. Reapply solder to reclose the connection.
JP3 = SparkFun-Jumpers:JUMPER-SMT_2_NO: Normally open jumper This jumper has two pads in close proximity to each other. Apply solder to close the connection. Round pads are easier to solder for beginners, but are a lot larger. SparkFun Product that uses the round pads: SparkFun EL Sequencer <https://www.sparkfun.com/products/12781>
NPN_1-NPN_16 = SnapEDA-Library:2N7002
PROTECT_R_1-PROTECT_R_16 R4 R5 R7-R11 R-TRANS-85-R-TRANS-100 R_PROTECT R_PROTECT2-R_PROTECT4 R_TO_GND R_TO_GND2-R_TO_GND4 = resistor:R-US_: RESISTOR, American symbol
REFULATOR_TANTALUM = rcl:C-US: CAPACITOR, American symbol; SPICEPREFIX: C
TP1-TP42 = testpad:TPSQ: Test pad
U1-U50 = Parts:TC4427AEOA: IC, MOSFET DRIVER, LOW SIDE; MPN: TC4427AEOA; OC_FARNELL: 1292285; OC_NEWARK: 96K4020; PACKAGE: SOIC-8; SUPPLIER: Microchip
U200 = SnapEDA-Library:ADA4091-2ARZ-RL: Precision Micropower Operational Amplifier; MPN: ADA4091-2ARZ-RL; OC_FARNELL: 1702289; OC_NEWARK: 34P2964; PACKAGE: SOIC-8; SUPPLIER: Analog Devices
U1200 = SnapEDA-Library (3):CD74HC4067SM96: 16-Channel Analog Multiplexer/Demultiplexer; MPN: CD74HC4067SM96; OC_FARNELL: 1601157; OC_NEWARK: 13N4201; PACKAGE: SOP-24; SUPPLIER: TEXAS INSTRUMENTS
U$1 = Parts:TEENSY_SMD
UA78M05CDCY = linear-technology:LT1129CST5: VOLTAGE REGULATOR with shutdown; MPN: LT1129CST-5#PBF; OC_FARNELL: 1663375; OC_NEWARK: 57M2069